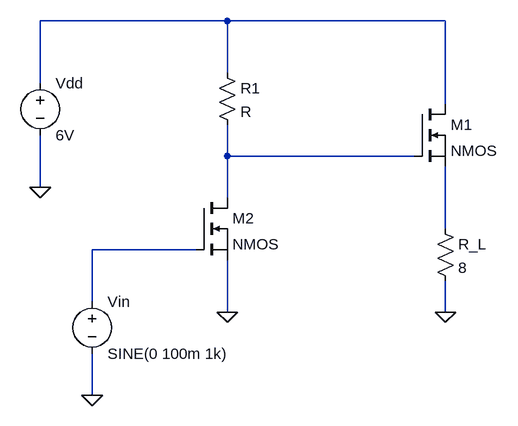
[diagram p0: schematic Draft1.asc]
Draft1.asc, the LTspice schematic file:
Version 4.1
SHEET 1 880 680
WIRE 304 16 16 16
WIRE 640 16 304 16
WIRE 304 96 304 16
WIRE 16 112 16 16
WIRE 640 144 640 16
WIRE 304 224 304 176
WIRE 592 224 304 224
WIRE 16 272 16 192
WIRE 304 288 304 224
WIRE 640 336 640 240
WIRE 256 368 96 368
WIRE 96 448 96 368
WIRE 304 464 304 384
WIRE 640 464 640 416
WIRE 96 592 96 528
FLAG 16 272 0
FLAG 640 464 0
FLAG 304 464 0
FLAG 96 592 0
SYMBOL voltage 16 96 R0
WINDOW 123 0 0 Left 0
WINDOW 39 0 0 Left 0
SYMATTR InstName Vdd
SYMATTR Value 6V
SYMBOL res 288 80 R0
SYMATTR InstName R1
SYMBOL res 624 320 R0
SYMATTR InstName R_L
SYMATTR Value 8
SYMBOL nmos 592 144 R0
SYMATTR InstName M1
SYMBOL nmos 256 288 R0
SYMATTR InstName M2
SYMBOL voltage 96 432 R0
WINDOW 123 0 0 Left 0
WINDOW 39 0 0 Left 0
SYMATTR InstName Vin
SYMATTR Value SINE(0 100m 1k)

The netlist it stands for:
* Draft1.asc
Vdd N001 0 6V
R1 N001 N002 R
R_L N003 0 8
M1 N001 N002 N003 N003 NMOS
M2 N002 N004 0 0 NMOS
Vin N004 0 SINE(0 100m 1k)
.model NMOS NMOS
.model PMOS PMOS
.lib standard.mos
.backanno
.end